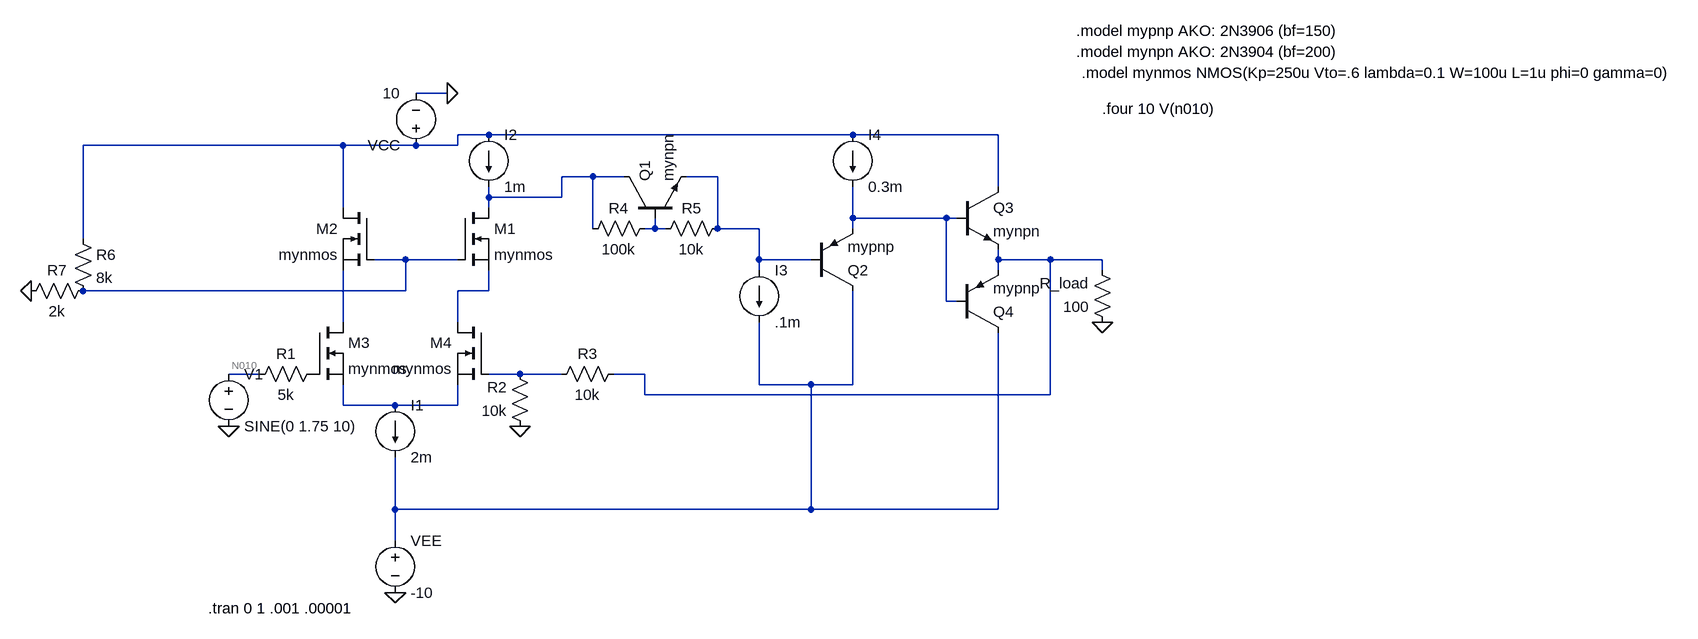
[diagram p0: schematic Draft1.asc]
Draft1.asc, the LTspice schematic file:
Version 4
SHEET 1 1768 824
WIRE -224 16 -272 16
WIRE -160 80 -208 80
WIRE 400 80 -160 80
WIRE 624 80 400 80
WIRE -384 96 -784 96
WIRE -272 96 -384 96
WIRE -208 96 -208 80
WIRE -208 96 -272 96
WIRE 0 144 -48 144
WIRE 48 144 0 144
WIRE 192 144 144 144
WIRE 624 160 624 80
WIRE -160 176 -160 160
WIRE -48 176 -48 144
WIRE -48 176 -160 176
WIRE -384 192 -384 96
WIRE -160 192 -160 176
WIRE 400 208 400 160
WIRE 544 208 400 208
WIRE 560 208 544 208
WIRE 0 224 0 144
WIRE 96 224 96 208
WIRE 96 224 80 224
WIRE 112 224 96 224
WIRE 192 224 192 144
WIRE 256 224 192 224
WIRE 400 224 400 208
WIRE -784 240 -784 96
WIRE -288 272 -336 272
WIRE -208 272 -288 272
WIRE 256 272 256 224
WIRE 336 272 256 272
WIRE 624 272 624 256
WIRE 704 272 624 272
WIRE 784 272 704 272
WIRE 256 288 256 272
WIRE 624 288 624 272
WIRE 784 288 784 272
WIRE -288 320 -288 272
WIRE -288 320 -784 320
WIRE -160 320 -160 288
WIRE -160 320 -208 320
WIRE 544 336 544 208
WIRE 560 336 544 336
WIRE -384 368 -384 288
WIRE -208 368 -208 320
WIRE -512 448 -560 448
WIRE -112 448 -160 448
WIRE -48 448 -112 448
WIRE 80 448 32 448
WIRE 256 464 256 368
WIRE 336 464 256 464
WIRE 400 464 400 320
WIRE 400 464 336 464
WIRE 80 480 80 448
WIRE 704 480 704 272
WIRE 704 480 80 480
WIRE -384 496 -384 464
WIRE -304 496 -384 496
WIRE -208 496 -208 464
WIRE -208 496 -304 496
WIRE -304 656 -304 576
WIRE 336 656 336 464
WIRE 336 656 -304 656
WIRE 624 656 624 384
WIRE 624 656 336 656
WIRE -304 704 -304 656
FLAG -560 528 0
FLAG -304 784 0
FLAG -224 16 0
FLAG -112 528 0
FLAG 784 368 0
FLAG -864 320 0
SYMBOL voltage -272 112 R180
WINDOW 123 0 0 Left 0
WINDOW 39 0 0 Left 0
SYMATTR InstName VCC
SYMATTR Value 10
SYMBOL voltage -304 688 R0
WINDOW 123 0 0 Left 0
WINDOW 39 0 0 Left 0
SYMATTR InstName VEE
SYMATTR Value -10
SYMBOL res -416 432 R90
WINDOW 0 0 56 VBottom 2
WINDOW 3 32 56 VTop 2
SYMATTR InstName R1
SYMATTR Value 5k
SYMBOL res -96 544 R180
WINDOW 0 36 76 Left 2
WINDOW 3 36 40 Left 2
SYMATTR InstName R2
SYMATTR Value 10k
SYMBOL res 48 432 R90
WINDOW 0 0 56 VBottom 2
WINDOW 3 32 56 VTop 2
SYMATTR InstName R3
SYMATTR Value 10k
SYMBOL res 96 208 R90
WINDOW 0 0 56 VBottom 2
WINDOW 3 32 56 VTop 2
SYMATTR InstName R4
SYMATTR Value 100k
SYMBOL res 208 208 R90
WINDOW 0 0 56 VBottom 2
WINDOW 3 32 56 VTop 2
SYMATTR InstName R5
SYMATTR Value 10k
SYMBOL res 800 384 R180
WINDOW 0 36 76 Left 2
WINDOW 3 36 40 Left 2
SYMATTR InstName R_load
SYMATTR Value 100
SYMBOL current -304 496 R0
WINDOW 123 0 0 Left 0
WINDOW 39 0 0 Left 0
SYMATTR InstName I1
SYMATTR Value 2m
SYMBOL current -160 80 R0
WINDOW 123 0 0 Left 0
WINDOW 39 0 0 Left 0
SYMATTR InstName I2
SYMATTR Value 1m
SYMBOL current 256 288 R0
WINDOW 123 0 0 Left 0
WINDOW 39 0 0 Left 0
SYMATTR InstName I3
SYMATTR Value .1m
SYMBOL current 400 80 R0
WINDOW 123 0 0 Left 0
WINDOW 39 0 0 Left 0
SYMATTR InstName I4
SYMATTR Value 0.3m
SYMBOL nmos -432 368 R0
SYMATTR InstName M3
SYMATTR Value mynmos
SYMBOL nmos -160 368 M0
SYMATTR InstName M4
SYMATTR Value mynmos
SYMBOL nmos -208 192 R0
SYMATTR InstName M1
SYMATTR Value mynmos
SYMBOL nmos -336 192 M0
SYMATTR InstName M2
SYMATTR Value mynmos
SYMBOL npn 48 208 R270
SYMATTR InstName Q1
SYMATTR Value mynpn
SYMBOL npn 560 160 R0
SYMATTR InstName Q3
SYMATTR Value mynpn
SYMBOL pnp 336 320 M180
SYMATTR InstName Q2
SYMATTR Value mypnp
SYMBOL pnp 560 384 M180
SYMATTR InstName Q4
SYMATTR Value mypnp
SYMBOL voltage -560 432 R0
WINDOW 123 0 0 Left 0
WINDOW 39 0 0 Left 0
SYMATTR InstName V1
SYMATTR Value SINE(0 1.75 10)
SYMBOL res -800 224 R0
SYMATTR InstName R6
SYMATTR Value 8k
SYMBOL res -768 304 R90
WINDOW 0 0 56 VBottom 2
WINDOW 3 32 56 VTop 2
SYMATTR InstName R7
SYMATTR Value 2k
TEXT 744 -80 Left 2 !.model mypnp AKO: 2N3906 (bf=150)
TEXT 744 -48 Left 2 !.model mynpn AKO: 2N3904 (bf=200)
TEXT 752 -16 Left 2 !.model mynmos NMOS(Kp=250u Vto=.6 lambda=0.1 W=100u L=1u phi=0 gamma=0)
TEXT -592 808 Left 2 !.tran 0 1 .001 .00001
TEXT 784 40 Left 2 !.four 10 V(n010)

The netlist it stands for:
* Draft1.asc
VCC N001 0 10
VEE N012 0 -10
R1 P001 N010 5k
R2 0 N011 10k
R3 N007 N011 10k
R4 N005 N002 100k
R5 N003 N005 10k
R_load 0 N007 100
I1 N013 N012 2m
I2 N001 N002 1m
I3 N003 N012 .1m
I4 N001 N004 0.3m
M3 N009 P001 N013 N013 mynmos
M4 N008 N011 N013 N013 mynmos
M1 N002 N006 N008 N008 mynmos
M2 N001 N006 N009 N009 mynmos
Q1 N002 N005 N003 0 mynpn
Q3 N001 N004 N007 0 mynpn
Q2 N012 N003 N004 0 mypnp
Q4 N012 N004 N007 0 mypnp
V1 N010 0 SINE(0 1.75 10)
R6 N001 N006 8k
R7 N006 0 2k
.model NPN NPN
.model PNP PNP
.lib standard.bjt
.model NMOS NMOS
.model PMOS PMOS
.lib standard.mos
.model mypnp AKO: 2N3906 (bf=150)
.model mynpn AKO: 2N3904 (bf=200)
.model mynmos NMOS(Kp=250u Vto=.6 lambda=0.1 W=100u L=1u phi=0 gamma=0)
.tran 0 1 .001 .00001
.four 10 V(n010)
.backanno
.end